# Altium schematic sheet Motor_Outputs.SchDoc
size A4; SheetNumber: 5; SheetTotal: 5
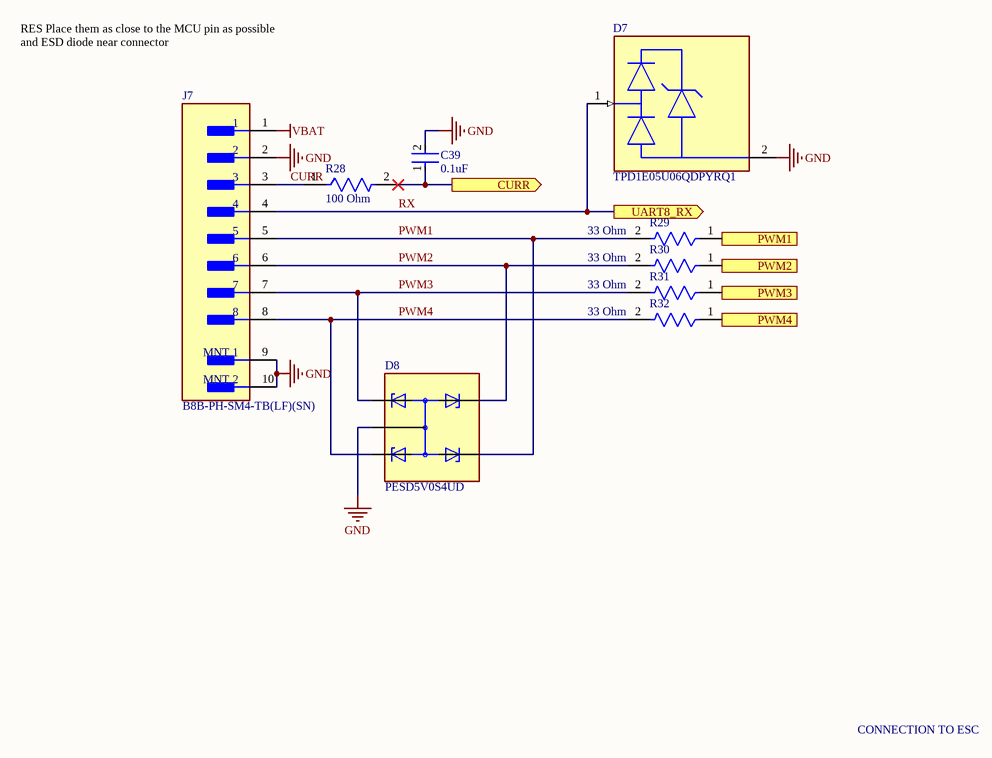
[diagram p0: Motor_Outputs.SchDoc]

## Parts
C39  0.1uF  [FP-C0402-BB-MFG]
D7  TPD1E05U06QDPYRQ1  [FP-DPY0002A-MFG]
D8  PESD5V0S4UD  [SOT457]
J7  B8B-PH-SM4-TB(LF)(SN)  [FP-B8B-PH-SM4-TB_LF_SN-MFG]
R28  100 Ohm  [FP-MCS0402-IPC_A]
R29  33 Ohm  [FP-RMCF0402-MFG]
R30  33 Ohm  [FP-RMCF0402-MFG]
R31  33 Ohm  [FP-RMCF0402-MFG]
R32  33 Ohm  [FP-RMCF0402-MFG]

## Ports
CURR (out, see EMP_FC_Main[2C], MCU_Core[4B]), PWM1 (in, see EMP_FC_Main[2C], MCU_Core[4B]), PWM2 (in, see EMP_FC_Main[2C], MCU_Core[4B]), PWM3 (in, see EMP_FC_Main[2C], MCU_Core[4B]), PWM4 (in, see EMP_FC_Main[2C], MCU_Core[4B]), UART8_RX (out, see EMP_FC_Main[2C], MCU_Core[3A])

## Nets
GND: C39.2 D7.2(GND) D8.2(CA) J7.2 J7.9(MNT_1) J7.10(MNT_2)
VBAT: J7.1
CURR: J7.3 R28.1
CURR: C39.1 R28.2 ; port CURR  [a separate net that carries the same name]
PWM1: D8.4(K3) J7.5 R29.2
PWM1: R29.1 ; port PWM1  [a separate net that carries the same name]
PWM2: D8.6(K4) J7.6 R30.2
PWM2: R30.1 ; port PWM2  [a separate net that carries the same name]
PWM3: D8.1(K1) J7.7 R31.2
PWM3: R31.1 ; port PWM3  [a separate net that carries the same name]
PWM4: D8.3(K2) J7.8 R32.2
PWM4: R32.1 ; port PWM4  [a separate net that carries the same name]
RX: D7.1(I/O) J7.4 ; port UART8_RX

Not connected (* = marked no-connect by the designer): D8 5(CA)

## Notes on the sheet
- RES Place them as close to the MCU pin as possible and ESD diode near connector
- CONNECTION TO ESC

## Library data of the parts
C39 = CMP-03020-002733-1: CAP CER 0.1UF 10V X7R 0402; Manufacturer: Kemet; Manufacturer Part Number: C0402C104K8RACAUTO; Material: Ceramic; Value: 0.10 μF; Tolerance: 0.1; Temperature Coefficient: 15%; ComponentLink2Description: Datasheet; Automotive: No; Digikey Description: CAP CER 0.1UF 10V X7R 0402; Temperature Range Low: -55°C; Ipc Land Pattern Name: CAPC10050X50; Lead Free: Yes; Category: Cap; Package: C0402-BB; Octopart: https://octopart.com/c0402c104k8racauto-kemet-9145167; Voltage Rating: 10 V; Device Class L2: Capacitors; Capacitance: 0.10 μF; Temperature Range High: +125°C; Height: 0.55mm; ComponentLink2URL: https://content.kemet.com/datasheets/KEM_C1002_X7R_SMD.pdf; Temperature: -55°C to +125°C; Device Class L1: Passive Components; Temperature Characteristic: X7R; RoHS: TRUE; Device Class L3: Ceramic Capacitors
D7 = CMP-04989-000010-1: TVS DIODE 5.5V 14V 2X1SON; Number of Channels: 1; Interface: LVDS; Max Operating Temperature: 125°C; Min Operating Temperature: -40°C; RoHS Compliant: Yes; Lead Free: Lead Free
D8 = PESD5V0S4UD: 13V Clamp 20A (8/20Âµs) Ipp Tvs Diode Surface Mount 6-TSOP; MF: NXP Semiconductors; SnapEDA_Link: https://www.snapeda.com/parts/PESD5V0S4UD/NXP+Semiconductors/view-part/?ref=snap; Package: None; Value: *; MP: PESD5V0S4UD; Check_prices: https://www.snapeda.com/parts/PESD5V0S4UD/NXP+Semiconductors/view-part/?ref=eda
J7 = CMP-17439-000195-1: CONN HEADER SMD 8POS 2MM; Current Rating: 2A; Insulation Resistance: 1GR; Mated Stacking Heights: 8.6mm; Gender: Male; Contact Resistance: 20mR; Number of Contacts: 8; Max Voltage Rating (AC): 100V; Pitch: 2mm; Fastening Type: Detent; Min Operating Temperature: -25°C; Contact Type: Male Pin; Series: PH; Contact Material: Copper Alloy; Termination: Solder; Contact Shape: Square; Depth: 5mm; Insulation Color: Natural; Housing Material: Polyamide; Max Current Rating: 2A; Color: White; Connector Type: Header; REACH SVHC: No SVHC; Insulation Material: Nylon; Number of Positions: 8; Height: 9.4mm; Width: 5.5mm; Max Operating Temperature: 85°C; Mount: Surface Mount; Orientation: Straight; Packaging: Tape and Reel; Working Voltage: 100V; Contact Mating Length: 0.13inch; Voltage Rating (AC): 100V; Housing Color: Beige; Length: 19.95mm; Contact Plating: Tin; Number of Poles: 8; Lead Free: Lead Free; Voltage Rating: 100V; Lead Pitch: 2mm; Contact Finish - Mating: TIN; Flammability Rating: UL94 V-0; Number of Rows: 1
R28 = CMP-02407-000150-1: RES SMD 1.2K OHM 1% 1/10W 0402; Resistance: 100R; Max Power Dissipation: 200mW; Tolerance: 0.5%; Temperature Coefficient: 25ppm/°C; Packaging: Cut Tape; Min Operating Temperature: -55°C; Case Code (Imperial): 0402; Features: Automotive AEC-Q200; Case/Package: 0402; Number of Terminations: 2; Max Operating Temperature: 175°C; Composition: Thin Film; Case Code (Metric): 1005
R29-R32 = CMP-26527-001180-1: 33Ω ±5% 0.063W 0402 Thick Film Chip Resistor AEC-Q200 compliant; Resistance: 33R; Max Power Dissipation: 63mW; Temperature Coefficient: 100ppm/°C; Case Code (Metric): 1005; Number of Terminations: 2; Mount: Surface Mount; Case Code (Imperial): 0402; Width: 0.02inch; Max Operating Temperature: 155°C; Radiation Hardening: No; Series: RMCF; Tolerance: 5%; Min Operating Temperature: -55°C; Length: 0.039inch; Case/Package: 0402; RoHS Compliant: Yes; Packaging: Tape and Reel; Features: Automotive AEC-Q200; Height: 0.016inch; Contact Plating: Tin; Resistor Type: Thick Film